# EAGLE schematic ACVoltage (EAGLE 6.0)
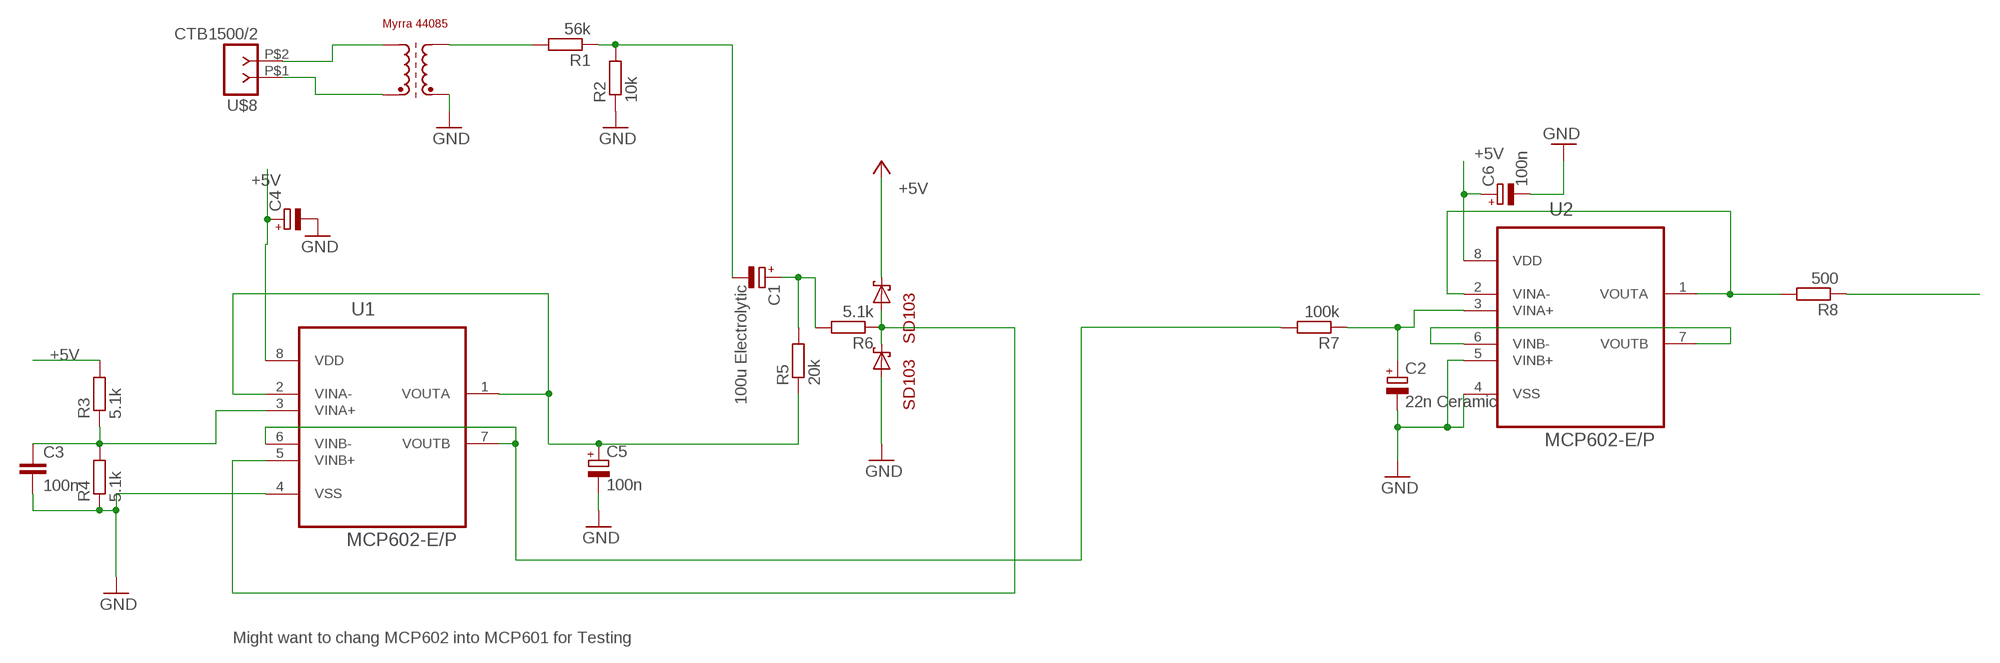
[diagram p0: schematic, sheet 1]

## Parts
C1  100u Electrolytic  CPOL1  [E2,5-7---100UF]
C2  22n Ceramic  CPOL1  [E2,5-7---100UF]
C3  100n  C5P  [C050-030-075]
C4  CPOL1  [E2,5-7---100UF]
C5  100n  CPOL1  [E2,5-7---100UF]
C6  100n  CPOL1  [E2,5-7---100UF]
R1  56k  R  [0207/10]
R2  10k  R  [0207/10]
R3  5.1k  R  [0207/10]
R4  5.1k  R  [0207/10]
R5  20k  R  [0207/10]
R6  5.1k  R  [0207/10]
R7  100k  R  [0207/10]
R8  500  R  [0207/10]
U1  MCP602-E/P  [DIP254P762X508-8P]
U2  MCP602-E/P  [DIP254P762X508-8P]
U$5  MYRRA_4408  [4408]
U$6  SD103A  [D035-10]
U$7  SD103A  [D035-10]
U$8  CTB1500/2  [CTB1500-2]

## Nets
+5V: C4.+ C6.+ R3.2 U1.8(VDD) U2.8(VDD) U$6.C ; supply symbol labelled +3V3
GND: C2.- C3.2 C4.- C5.- C6.- R2.1 R4.1 U1.4(VSS) U2.4(VSS) U2.5(VINB+) U$5.PIN9(E2) U$7.A
N$1: R7.2 U1.6(VINB-) U1.7(VOUTB)
N$2: C5.+ R5.1 U1.1(VOUTA) U1.2(VINA-)
N$3: C2.+ R7.1 U2.3(VINA+)
N$4: R8.2 U2.1(VOUTA) U2.2(VINA-)
N$5: R8.1
N$6: U2.6(VINB-) U2.7(VOUTB)
N$10: C3.1 R3.1 R4.2 U1.3(VINA+)
N$11: U$5.PIN5(A1) U$8.P$2
N$12: R6.1 U1.5(VINB+) U$6.A U$7.C
N$15: U$5.PIN1(E1) U$8.P$1
N$17: C1.- R1.1 R2.2
N$18: R1.2 U$5.PIN7(A2)
N$21: C1.+ R5.2 R6.2

## Notes on the sheet
- Might want to chang MCP602 into MCP601 for Testing

## Library data of the parts
C1 C2 C4-C6 = ee2parts:CPOL: Electrolytic (polarised) capacitor
C3 = ee2parts:C: Capacitor
R1-R8 = ee2parts:R: Resistor
U1 U2 = MCP:MCP602-E/P: IC, 2.7V to 5.5V Single-Supply CMOS Dual Op Amps,DIP-8; MPN: MCP602-E/P; OC_FARNELL: 1852042; OC_NEWARK: 88H9870; PACKAGE: DIP-8; SUPPLIER: Microchip
U$5 = Pauls_parts:MYRRA_4408
U$6 U$7 = Pauls_parts:SD103A
U$8 = eko-parts:CTB1500/2